# EAGLE design micromouse (EAGLE 9.6.2)
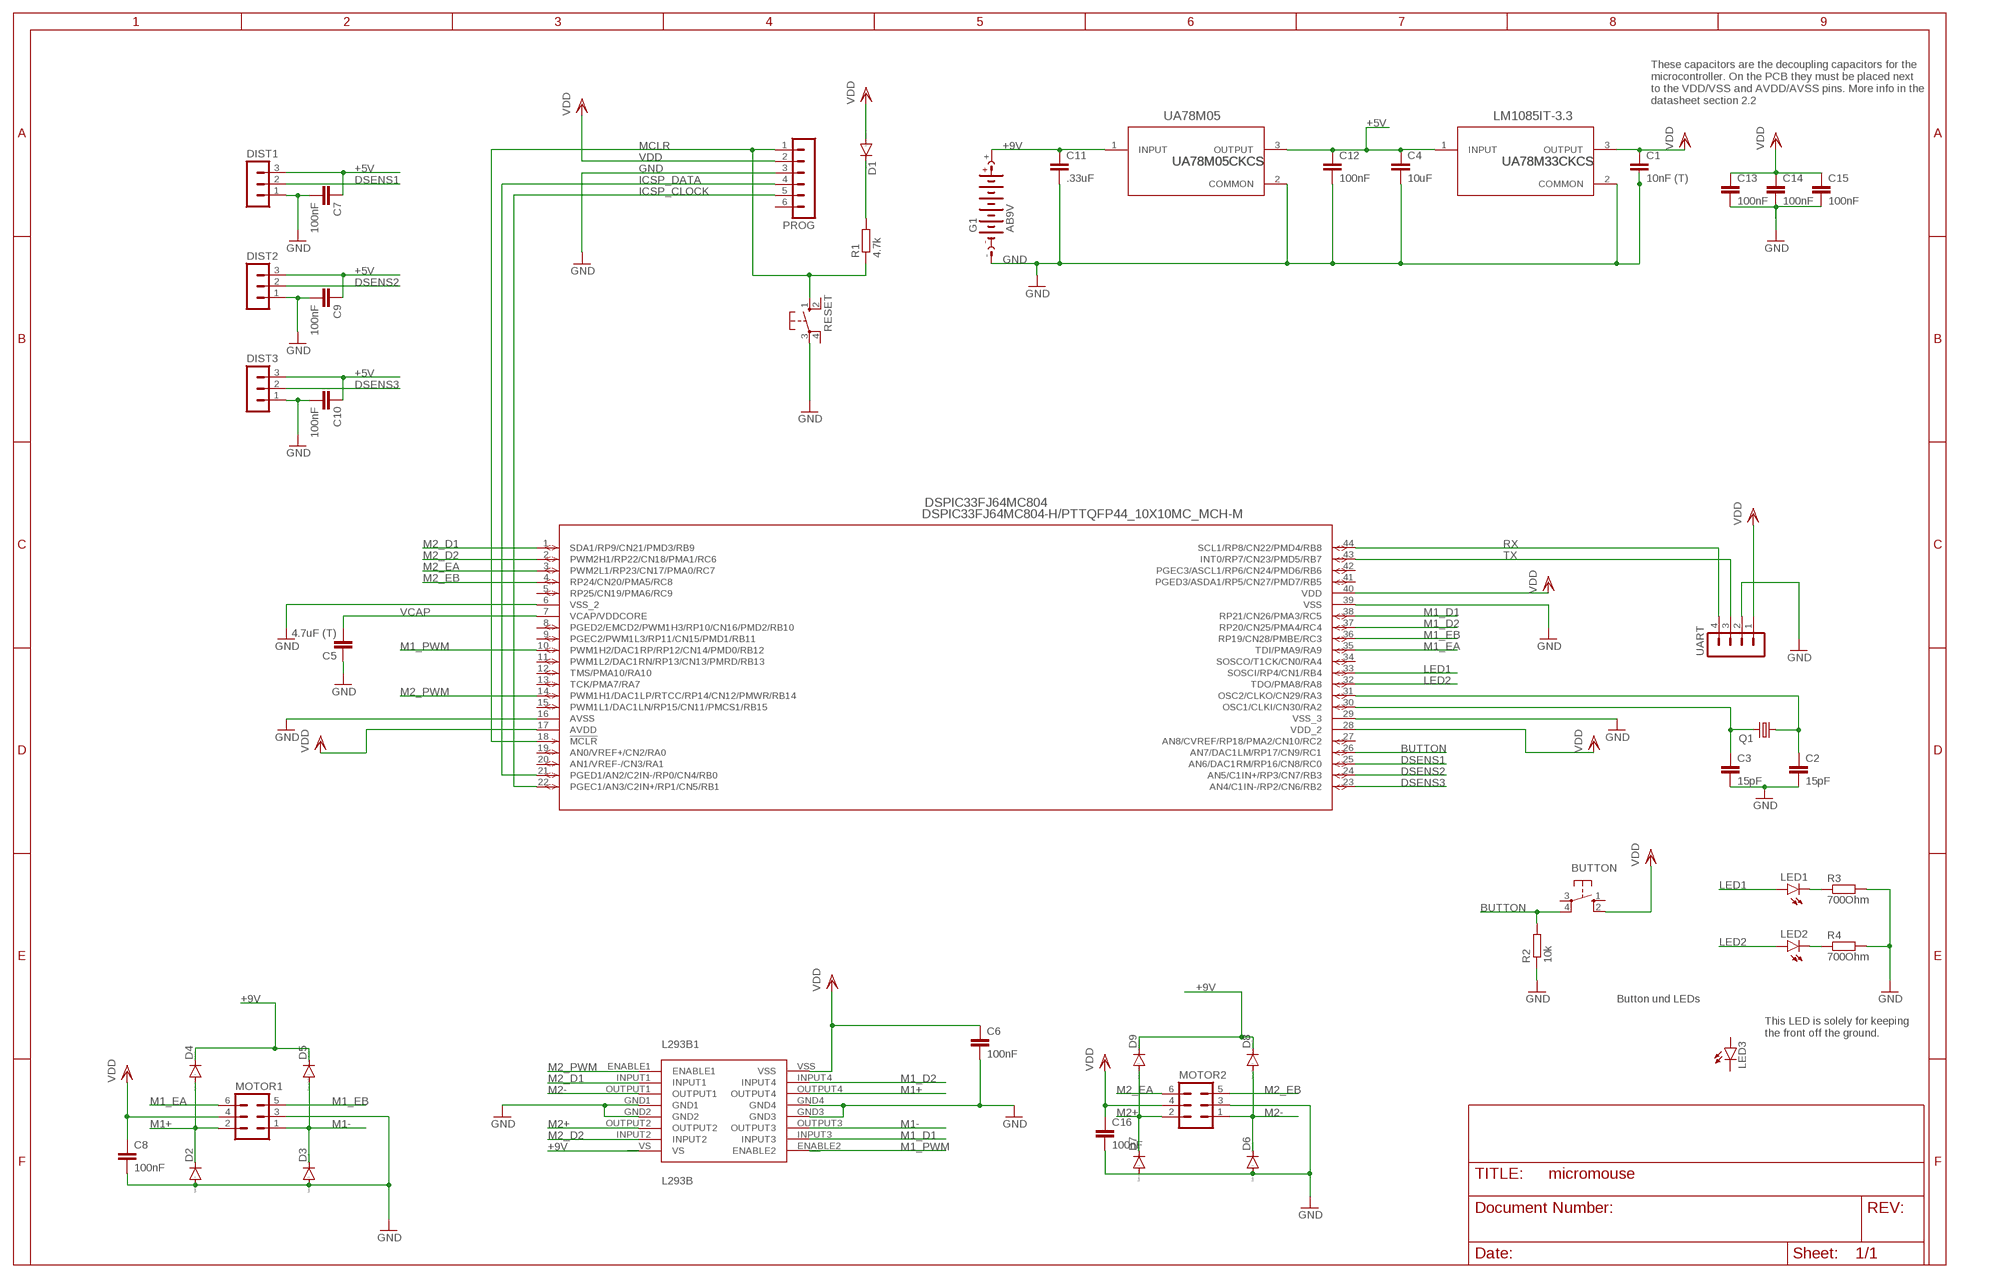
[diagram p0: schematic, sheet 1]

## Parts
BUTTON  10-XX  [B3F-10XX]
C1  10nF (T)  C-EUC0805  [C0805]
C2  15pF  C-EUC0805  [C0805]
C3  15pF  C-EUC0805  [C0805]
C4  10uF  C-EUC0805  [C0805]
C5  4.7uF (T)  C-EUC0805  [C0805]
C6  100nF  C-EUC0805  [C0805]
C7  100nF  C-EUC0805  [C0805]
C8  100nF  C-EUC0805  [C0805]
C9  100nF  C-EUC0805  [C0805]
C10  100nF  C-EUC0805  [C0805]
C11  .33uF  C-EUC0805  [C0805]
C12  100nF  C-EUC0805  [C0805]
C13  100nF  C-EUC0805  [C0805]
C14  100nF  C-EUC0805  [C0805]
C15  100nF  C-EUC0805  [C0805]
C16  100nF  C-EUC0805  [C0805]
D1  DIODE-SOD123  [SOD123]
D2  DIODE-SOD123  [SOD123]
D3  DIODE-SOD123  [SOD123]
D4  DIODE-SOD123  [SOD123]
D5  DIODE-SOD123  [SOD123]
D6  DIODE-SOD123  [SOD123]
D7  DIODE-SOD123  [SOD123]
D8  DIODE-SOD123  [SOD123]
D9  DIODE-SOD123  [SOD123]
DIST1  MA03-1  [MA03-1]
DIST2  MA03-1  [MA03-1]
DIST3  MA03-1  [MA03-1]
DSPIC33FJ64MC804  DSPIC33FJ64MC804-H/PTTQFP44_10X10MC_MCH-M  [TQFP44_10X10MC_MCH-M]
G1  AB9V  [AB9V]
L293B1  L293B  [L293P-DIP16]
LED1  LEDCHIP-LED0805  [CHIP-LED0805]
LED2  LEDCHIP-LED0805  [CHIP-LED0805]
LED3  LED5MM  [LED5MM]
LM1085IT-3.3  UA78M33CKCS  [KCS0003B]
MOTOR1  MA03-2  [MA03-2]
MOTOR2  MA03-2  [MA03-2]
PROG  MA06-1  [MA06-1]
Q1  CRYSTALHC49S  [HC49/S]
R1  4.7k  R-EU_R0805  [R0805]
R2  10k  R-EU_R0805  [R0805]
R3  700Ohm  R-EU_R0805  [R0805]
R4  700Ohm  R-EU_R0805  [R0805]
RESET  10-XX  [B3F-10XX]
UA78M05  UA78M05CKCS  [KCS0003B]
UART  MA04-1  [MA04-1]

## Nets
+5V: C4.1 C7.1 C9.1 C10.1 C12.1 DIST1.3 DIST2.3 DIST3.3 LM1085IT-3.3.1(INPUT) UA78M05.3(OUTPUT)
+9V: C11.1 D4.C D5.C D8.C D9.C G1.+ L293B1.VS UA78M05.1(INPUT)
BUTTON: BUTTON.4(P1) DSPIC33FJ64MC804.26(AN7/DAC1LM/RP17/CN9/RC1) R2.2
DSENS1: DIST1.2 DSPIC33FJ64MC804.25(AN6/DAC1RM/RP16/CN8/RC0)
DSENS2: DIST2.2 DSPIC33FJ64MC804.24(AN5/C1IN+/RP3/CN7/RB3)
DSENS3: DIST3.2 DSPIC33FJ64MC804.23(AN4/C1IN-/RP2/CN6/RB2)
GND: C1.2 C2.2 C3.2 C4.2 C5.1 C6.2 C7.2 C8.2 C9.2 C10.2 C11.2 C12.2 C13.2 C14.2 C15.2 C16.2 D2.A D3.A D6.A D7.A DIST1.1 DIST2.1 DIST3.1 DSPIC33FJ64MC804.6(VSS_2) DSPIC33FJ64MC804.16(AVSS) DSPIC33FJ64MC804.29(VSS_3) DSPIC33FJ64MC804.39(VSS) G1.- L293B1.GND1 L293B1.GND2 L293B1.GND3 L293B1.GND4 LM1085IT-3.3.2(COMMON) MOTOR1.3 MOTOR2.3 PROG.3 R2.1 R3.2 R4.2 RESET.3(P) UA78M05.2(COMMON) UART.2
ICSP_CLOCK: DSPIC33FJ64MC804.22(PGEC1/AN3/C2IN+/RP1/CN5/RB1) PROG.5
ICSP_DATA: DSPIC33FJ64MC804.21(PGED1/AN2/C2IN-/RP0/CN4/RB0) PROG.4
LED1: DSPIC33FJ64MC804.33(SOSCI/RP4/CN1/RB4) LED1.A
LED2: DSPIC33FJ64MC804.32(TDO/PMA8/RA8) LED2.A
M1+: D2.C D4.A L293B1.OUTPUT4 MOTOR1.2
M1-: D3.C D5.A L293B1.OUTPUT3 MOTOR1.1
M1_D1: DSPIC33FJ64MC804.38(RP21/CN26/PMA3/RC5) L293B1.INPUT3
M1_D2: DSPIC33FJ64MC804.37(RP20/CN25/PMA4/RC4) L293B1.INPUT4
M1_EA: DSPIC33FJ64MC804.35(TDI/PMA9/RA9) MOTOR1.6
M1_EB: DSPIC33FJ64MC804.36(RP19/CN28/PMBE/RC3) MOTOR1.5
M1_PWM: DSPIC33FJ64MC804.10(PWM1H2/DAC1RP/RP12/CN14/PMD0/RB12) L293B1.ENABLE2
M2+: D7.C D9.A L293B1.OUTPUT2 MOTOR2.2
M2-: D6.C D8.A L293B1.OUTPUT1 MOTOR2.1
M2_D1: DSPIC33FJ64MC804.1(SDA1/RP9/CN21/PMD3/RB9) L293B1.INPUT1
M2_D2: DSPIC33FJ64MC804.2(PWM2H1/RP22/CN18/PMA1/RC6) L293B1.INPUT2
M2_EA: DSPIC33FJ64MC804.3(PWM2L1/RP23/CN17/PMA0/RC7) MOTOR2.6
M2_EB: DSPIC33FJ64MC804.4(RP24/CN20/PMA5/RC8) MOTOR2.5
M2_PWM: DSPIC33FJ64MC804.14(PWM1H1/DAC1LP/RTCC/RP14/CN12/PMWR/RB14) L293B1.ENABLE1
MCLR: DSPIC33FJ64MC804.18(!MCLR) PROG.1 R1.1 RESET.1(S)
N$4: C3.1 DSPIC33FJ64MC804.30(OSC1/CLKI/CN30/RA2) Q1.2
N$5: C2.1 DSPIC33FJ64MC804.31(OSC2/CLKO/CN29/RA3) Q1.1
N$10: D1.C R1.2
N$12: LED1.C R3.1
N$13: LED2.C R4.1
RX: DSPIC33FJ64MC804.44(SCL1/RP8/CN22/PMD4/RB8) UART.4
TX: DSPIC33FJ64MC804.43(INT0/RP7/CN23/PMD5/RB7) UART.3
VCAP: C5.2 DSPIC33FJ64MC804.7(VCAP/VDDCORE)
VDD: BUTTON.2(S1) C1.1 C6.1 C8.1 C13.1 C14.1 C15.1 C16.1 D1.A DSPIC33FJ64MC804.17(AVDD) DSPIC33FJ64MC804.28(VDD_2) DSPIC33FJ64MC804.40(VDD) L293B1.VSS LM1085IT-3.3.3(OUTPUT) MOTOR1.4 MOTOR2.4 PROG.2 UART.1
Unconnected: BUTTON.1(S) BUTTON.3(P) DSPIC33FJ64MC804.5(RP25/CN19/PMA6/RC9) DSPIC33FJ64MC804.8(PGED2/EMCD2/PWM1H3/RP10/CN16/PMD2/RB10) DSPIC33FJ64MC804.9(PGEC2/PWM1L3/RP11/CN15/PMD1/RB11) DSPIC33FJ64MC804.11(PWM1L2/DAC1RN/RP13/CN13/PMRD/RB13) DSPIC33FJ64MC804.12(TMS/PMA10/RA10) DSPIC33FJ64MC804.13(TCK/PMA7/RA7) DSPIC33FJ64MC804.15(PWM1L1/DAC1LN/RP15/CN11/PMCS1/RB15) DSPIC33FJ64MC804.19(AN0/VREF+/CN2/RA0) DSPIC33FJ64MC804.20(AN1/VREF-/CN3/RA1) DSPIC33FJ64MC804.27(AN8/CVREF/RP18/PMA2/CN10/RC2) DSPIC33FJ64MC804.34(SOSCO/T1CK/CN0/RA4) DSPIC33FJ64MC804.41(PGED3/ASDA1/RP5/CN27/PMD7/RB5) DSPIC33FJ64MC804.42(PGEC3/ASCL1/RP6/CN24/PMD6/RB6) LED3.A LED3.K(C) PROG.6 RESET.2(S1) RESET.4(P1)

## Notes on the sheet
- Power Supply
- These capacitors are the decoupling capacitors for the
  microcontroller. On the PCB they must be placed next
  to the VDD/VSS and AVDD/AVSS pins. More info in the
  datasheet section 2.2
- Distance Sensors | Programmer
- Reset Button
- UART Connector
  (Bluethooth / USB)
- Oscillator
- Motor 2
- Motor 1
- Motor Control | Button und LEDs
- This LED is solely for keeping
  the front off the ground.

## Library data of the parts
BUTTON RESET = switch-omron:10-XX: OMRON SWITCH; MPN: B3F-1000; OC_FARNELL: 176432; OC_NEWARK: 36M3542
C1-C16 = rcl:C-EU: CAPACITOR, European symbol; SPICEPREFIX: C
D1-D9 = diode:DIODE-: DIODE
DIST1-DIST3 = con-lstb:MA03-1: PIN HEADER; OC_FARNELL: unknown; OC_NEWARK: unknown
DSPIC33FJ64MC804 = micromouse:DSPIC33FJ64MC804-H/PT; COPYRIGHT: Copyright (C) 2022 Ultra Librarian. All rights reserved.; MANUFACTURER_PART_NUMBER: DSPIC33FJ64MC804-H/PT; MFR_NAME: Microchip
G1 = battery:AB9V: 9-V BATTERY CLIP
L293B1 = micromouse:L293B
LED1-LED3 = led:LED: LED OSRAM: - CHIPLED LG R971, LG N971, LY N971, LG Q971, LY Q971, LO R971, LY R971 LH N974, LH R974 LS Q976, LO Q976, LY Q976 LO Q996 - Hyper CHIPLED LW Q18S LB Q993, LB Q99A, LB R99A - SideLED LS A670, LO A670, LY A670, LG A670, LP A670 LB A673, LV A673, LT A673, LW A673 LH A674 LY A675 LS A676, LA A676, LO A676, LY A676, LW A676 LS A679, LY A679, LG A679 - Hyper Micro SIDELED® LS Y876, LA Y876, LO Y876, LY Y876 LT Y87S - SmartLED LW L88C, LW L88S LB L89C, LB L89S, LG L890 LS L89K, LO L89K, LY L89K LS L896, LA L896, LO L896, LY L896 - TOPLED LS T670, LO T670, LY T670, LG T670, LP T670 LSG T670, LSP T670, LSY T670, LOP T670, LYG T670 LG T671, LOG T671, LSG T671 LB T673, LV T673, LT T673, LW T673 LH T674 LS T676, LA T676, LO T676, LY T676, LB T676, LH T676, LSB T676, LW T676 LB T67C, LV T67C, LT T67C, LS T67K, LO T67K, LY T67K, LW E67C LS E67B, LA E67B, LO E67B, LY E67B, LB E67C, LV E67C, LT E67C LW T67C LS T679, LY T679, LG T679 LS T770, LO T770, LY T770, LG T770, LP T770 LB T773, LV T773, LT T773, LW T773 LH T774 LS E675, LA E675, LY E675, LS T675 LS T776, LA T776, LO T776, LY T776, LB T776 LHGB T686 LT T68C, LB T68C - Hyper Mini TOPLED® LB M676 - Mini TOPLED Santana® LG M470 LS M47K, LO M47K, LY M47K Source: http://www.osram.convergy.de LUXEON: - LUMILED® LXK2-PW12-R00, LXK2-PW12-S00, LXK2-PW14-U00, LXK2-PW14-V00 LXK2-PM12-R00, LXK2-PM12-S00, LXK2-PM14-U00 LXK2-PE12-Q00, LXK2-PE12-R00, LXK2-PE12-S00, LXK2-PE14-T00, LXK2-PE14-U00 LXK2-PB12-K00, LXK2-PB12-L00, LXK2-PB12-M00, LXK2-PB14-N00, LXK2-PB14-P00, LXK2-PB14-Q00 LXK2-PR12-L00, LXK2-PR12-M00, LXK2-PR14-Q00, LXK2-PR14-R00 LXK2-PD12-Q00, LXK2-PD12-R00, LXK2-PD12-S00 LXK2-PH12-R00, LXK2-PH12-S00 LXK2-PL12-P00, LXK2-PL12-Q00, LXK2-PL12-R00 Source: www.luxeon.com KINGBRIGHT: KA-3528ASYC Source: www.kingbright.com
LM1085IT-3.3 = micromouse:UA78M33CKCS; COPYRIGHT: Copyright (C) 2022 Ultra Librarian. All rights reserved.; MANUFACTURER_PART_NUMBER: UA78M05CKCS; MFR_NAME: Texas Instruments; REFDES: RefDes; TYPE: TYPE
MOTOR1 MOTOR2 = con-lstb:MA03-2: PIN HEADER; OC_FARNELL: unknown; OC_NEWARK: unknown
PROG = con-lstb:MA06-1: PIN HEADER; OC_FARNELL: unknown; OC_NEWARK: unknown
Q1 = crystal:CRYSTAL: CRYSTAL; OC_FARNELL: 1667008; OC_NEWARK: unknown
R1-R4 = rcl:R-EU_: RESISTOR, European symbol; SPICEPREFIX: R
UA78M05 = micromouse:UA78M05CKCS; COPYRIGHT: Copyright (C) 2022 Ultra Librarian. All rights reserved.; MANUFACTURER_PART_NUMBER: UA78M05CKCS; MFR_NAME: Texas Instruments; REFDES: RefDes; TYPE: TYPE
UART = con-lstb:MA04-1: PIN HEADER; OC_FARNELL: unknown; OC_NEWARK: unknown

## Board
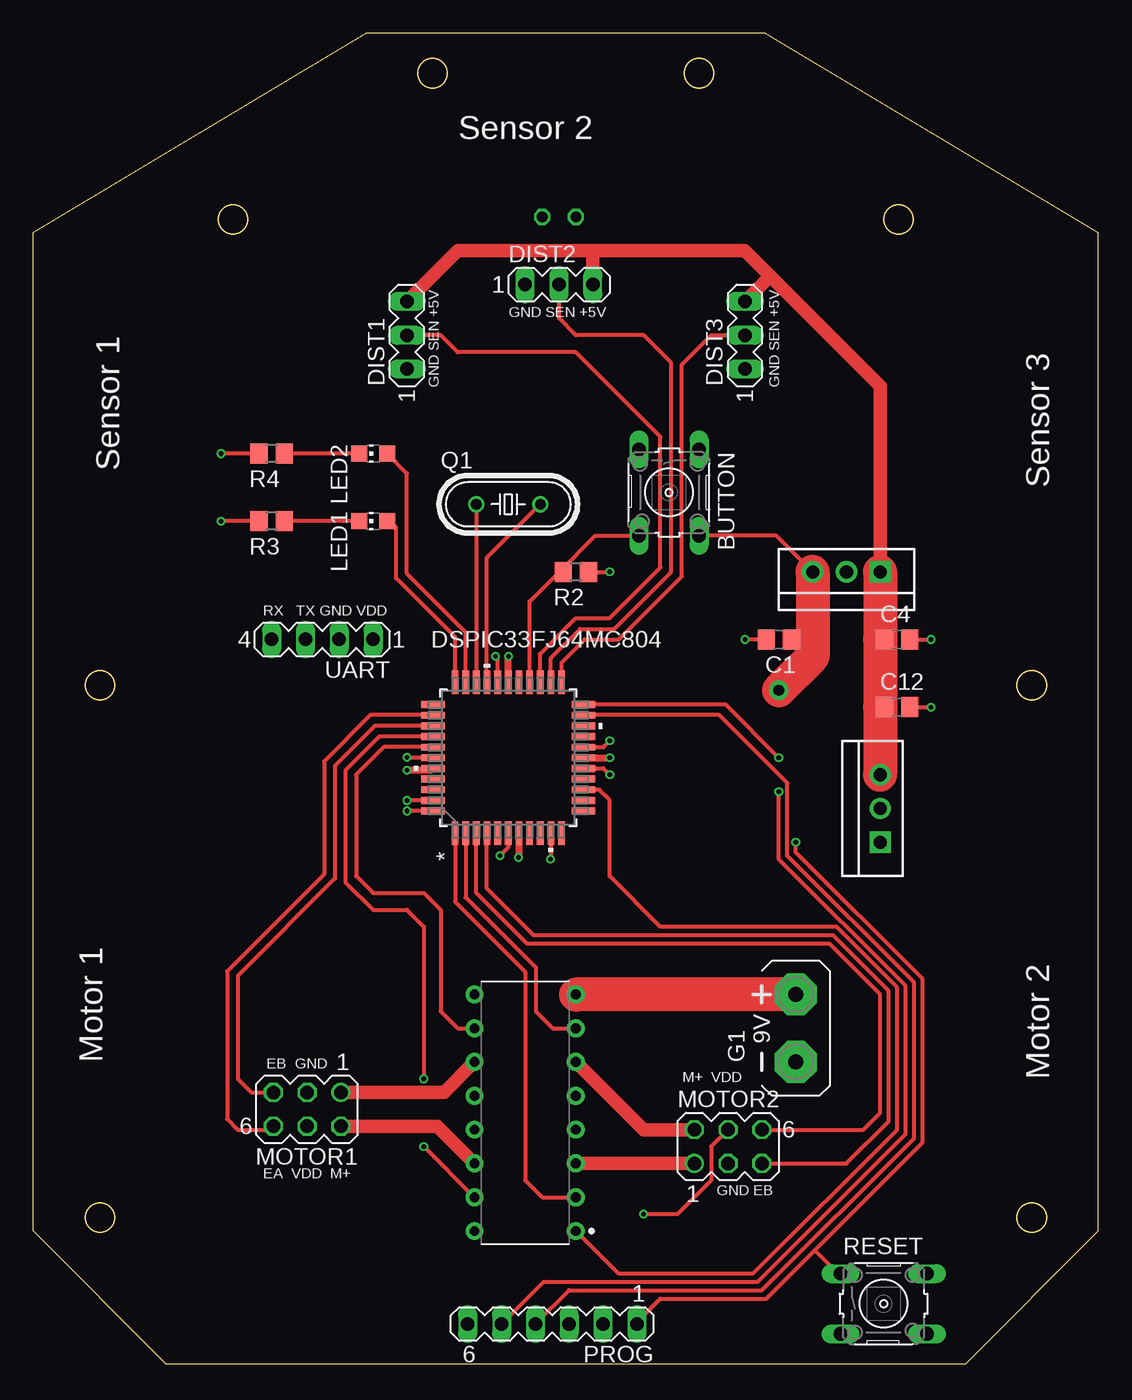
[diagram p1: board, top side]
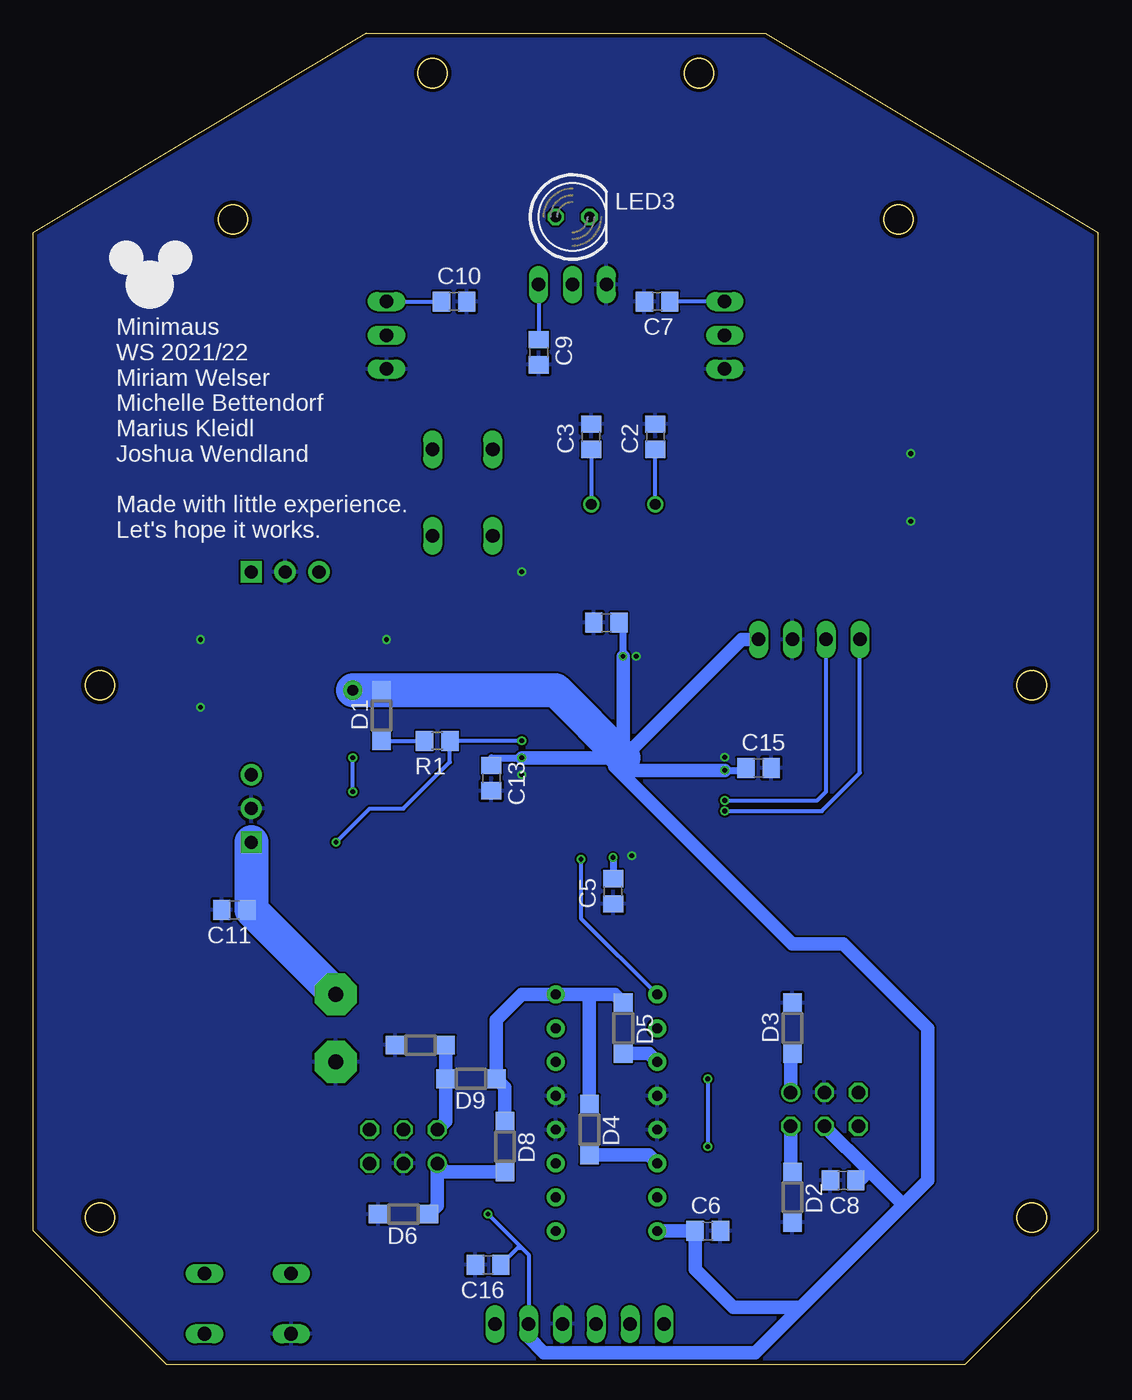
[diagram p2: board, bottom side, seen from below]

Size 80 x 100 mm. Coordinates in mm from the lower left corner, seen from the top.
Outline: 70,0 80,10 80,85 55,100 25,100 0,85 0,10 10,0 70,0
Outline: circle at 75,11 radius 1.1
Outline: circle at 5,51 radius 1.1
Outline: circle at 30,97 radius 1.1
Outline: circle at 15,86.01 radius 1.1
Outline: circle at 5,11 radius 1.1
Outline: circle at 75,51 radius 1.1
Outline: circle at 50,97 radius 1.1
Outline: circle at 65,86.01 radius 1.1
Copper layers (1*16): Top 0.035mm / dielectric 1.5mm / Bottom 0.035mm
Design rules "PCB-POOL Standard": minimum track width 0.15mm, minimum drill 0.3mm, track to track 0.15mm, track to pad 0.15mm, pad to pad 0.15mm, via to via 0.15mm, smd to smd 0.15mm, copper to edge 0.3mm, drill to drill 0.2mm, minimum pad ring 0.2mm, minimum via ring 0.15mm, stop-mask expansion 0.03mm, vias tented up to drill 0mil, thermal gap 0.2mm

### Footprints (pad centres in the part's own frame; a part is rotated, then mirrored left to right if it is on the bottom)
B3F-10XX = drill 1.016 long: 1 -3.251,2.261; 2 3.251,2.261; 3 -3.251,-2.261; 4 3.251,-2.261
C0805 = smd 1.3 x 1.5: 1 -0.95,0; 2 0.95,0
SOD123 = smd 1.4 x 1.4: A 1.9,0; C -1.9,0
MA03-1 = drill 1.016 long: 1 -2.54,0; 2 0,0; 3 2.54,0
TQFP44_10X10MC_MCH-M = smd 1.762 x 0.507: 1 -5.663,4; 2 -5.663,3.2; 3 -5.663,2.4; 4 -5.663,1.6; 5 -5.663,0.8; 6 -5.663,0; 7 -5.663,-0.8; 8 -5.663,-1.6; 9 -5.663,-2.4; 10 -5.663,-3.2; 11 -5.663,-4; 23 5.663,-4; 24 5.663,-3.2; 25 5.663,-2.4; 26 5.663,-1.6; 27 5.663,-0.8; 28 5.663,0; 29 5.663,0.8; 30 5.663,1.6; 31 5.663,2.4; 32 5.663,3.2; 33 5.663,4 | smd 0.507 x 1.762: 12 -4,-5.663; 13 -3.2,-5.663; 14 -2.4,-5.663; 15 -1.6,-5.663; 16 -0.8,-5.663; 17 0,-5.663; 18 0.8,-5.663; 19 1.6,-5.663; 20 2.4,-5.663; 21 3.2,-5.663; 22 4,-5.663; 34 4,5.663; 35 3.2,5.663; 36 2.4,5.663; 37 1.6,5.663; 38 0.8,5.663; 39 0,5.663; 40 -0.8,5.663; 41 -1.6,5.663; 42 -2.4,5.663; 43 -3.2,5.663; 44 -4,5.663
AB9V = drill 1.118 pad 3.15 octagon: + 0,2.54; - 0,-2.54
L293P-DIP16 = drill 0.743 pad 1.343: ENABLE1 -3.81,8.89; ENABLE2 3.81,-8.89; GND1 -3.81,1.27; GND2 -3.81,-1.27; GND3 3.81,-1.27; GND4 3.81,1.27; INPUT1 -3.81,6.35; INPUT2 -3.81,-6.35; INPUT3 3.81,-6.35; INPUT4 3.81,6.35; OUTPUT1 -3.81,3.81; OUTPUT2 -3.81,-3.81; OUTPUT3 3.81,-3.81; OUTPUT4 3.81,3.81; VS -3.81,-8.89; VSS 3.81,8.89
CHIP-LED0805 = smd 1.2 x 1.2: A 0,-1.05; C 0,1.05
LED5MM = drill 0.813 octagon: A -1.27,0; K 1.27,0
KCS0003B = drill 0.991 pad 1.6 square: 1 0,2.54 | drill 0.991 pad 1.6: 2 0,0; 3 0,-2.54
MA03-2 = drill 1.016: 1 -2.54,-1.27 | drill 1.016 octagon: 2 -2.54,1.27; 3 0,-1.27; 4 0,1.27; 5 2.54,-1.27; 6 2.54,1.27
MA06-1 = drill 1.016 long: 1 -6.35,0; 2 -3.81,0; 3 -1.27,0; 4 1.27,0; 5 3.81,0; 6 6.35,0
HC49/S = drill 0.813: 1 -2.413,0; 2 2.413,0
R0805 = smd 1.3 x 1.5: 1 -0.95,0; 2 0.95,0
MA04-1 = drill 1.016 long: 1 -3.81,0; 2 -1.27,0; 3 1.27,0; 4 3.81,0

### Placement (x,y rotation side)
BUTTON  47.75,65.49 270 top
C1  56,54.45 180 top
C2  33.27,69.68 90 bottom
C3  38.09,69.68 90 bottom
C4  64.89,54.45 0 top
C5  36.44,35.52 90 bottom
C6  29.33,10 0 bottom
C7  33.14,79.84 180 bottom
C8  19.17,13.81 180 bottom
C9  42.03,76.03 270 bottom
C10  48.38,79.84 0 bottom
C11  64.89,34.12 180 bottom
C12  64.89,49.37 0 top
C13  45.59,44.03 270 bottom
C14  36.95,55.72 180 bottom
C15  25.52,44.79 0 bottom
C16  45.84,7.46 180 bottom
D1  53.84,48.73 90 bottom
D2  22.98,12.54 270 bottom
D3  22.98,25.23 90 bottom
D4  38.22,17.62 270 bottom
D5  35.68,25.23 270 bottom
D6  52.19,11.27 180 bottom
D7  50.92,23.96 180 bottom
D8  44.57,16.35 270 bottom
D9  47.11,21.43 180 bottom
DIST1  28.06,77.3 90 top
DIST2  39.49,81.11 0 top
DIST3  53.46,77.3 90 top
DSPIC33FJ64MC804  35.68,45.55 90 top
G1  57.27,25.23 0 top
L293B1  36.95,18.89 180 top
LED1  25.52,63.34 90 top
LED2  25.52,68.41 90 top
LED3  39.49,86.19 0 bottom
LM1085IT-3.3  61.08,59.52 270 top
MOTOR1  20.57,19.14 180 top
MOTOR2  52.19,16.35 0 top
PROG  38.98,3.01 180 top
Q1  35.68,64.6 0 top
R1  49.65,46.83 180 bottom
R2  40.76,59.52 180 top
R3  17.9,63.34 180 top
R4  17.9,68.41 180 top
RESET  63.88,4.53 0 top
UA78M05  63.62,41.74 180 top
UART  21.71,54.45 180 top

### Tracks (layer width: path | path; a pad name or v marks a point on that pad's centre or on a via)
+5V
  Top 1.016: LM1085IT-3.3.1 63.62,73.49 55.37,81.75 | 55.37,81.75 53.46,83.65 42.03,83.65 | 42.03,83.65 31.87,83.65 DIST1.3 | 42.03,83.65 DIST2.3 | DIST3.3 55.37,81.75 | C4.1 63.62,54.45 | C12.1 63.62,49.37
  Top 2.54: LM1085IT-3.3.1 63.62,54.45 63.62,49.37 UA78M05.3
  Bottom 0.305: DIST1.3 C7.1 | DIST2.3 C9.1 | DIST3.3 C10.1
+9V
  Top 2.54: G1.+ L293B1.VS
  Bottom 1.016: C11.1 63.62,34.12 | D4.C 38.22,27.78 | 38.22,27.78 L293B1.VS 43.3,27.78 45.21,25.87 D9.C 44.57,20.79 D8.C | 38.22,27.78 36.32,27.78 D5.C
  Bottom 2.54: UA78M05.1 63.62,34.12 G1.+
BUTTON
  Top 0.305: DSPIC33FJ64MC804.26 37.28,57.31 39.49,59.52 | BUTTON.4 42.21,62.24 39.49,59.52 | R2.2 39.49,59.52
DSENS1
  Top 0.305: DIST1.2 30.6,77.3 31.87,76.03 40.76,76.03 47.11,69.68 47.11,59.86 43.3,56.05 40.76,56.05 38.08,53.37 DSPIC33FJ64MC804.25
DSENS2
  Top 0.305: DIST2.2 39.49,78.57 40.76,77.3 45.84,77.3 47.91,75.23 47.91,59.52 43.63,55.24 41.09,55.24 38.88,53.04 DSPIC33FJ64MC804.24
DSENS3
  Top 0.305: DSPIC33FJ64MC804.23 39.68,52.71 41.42,54.45 43.97,54.45 48.71,59.19 48.71,75.09 50.92,77.3 DIST3.2
GND  (via drill 0.35)
  Top 0.305: R4.2 v14.09,68.41 | R3.2 v14.09,63.34 | DSPIC33FJ64MC804.29 34.88,53 v34.71,53.18 | DSPIC33FJ64MC804.16 42.83,44.76 v43.3,44.29 | DSPIC33FJ64MC804.6 35.68,38.82 v35.05,38.19 | C4.2 v67.43,54.45 | DSPIC33FJ64MC804.39 28.1,45.55 v28.06,45.59 | R2.1 v43.3,59.52 | C12.2 v67.43,49.37 | C1.2 v53.46,54.45
  pour Bottom: 10.28,-0.17 0.12,10 0.12,84.92 15.36,100.16 64.89,100.16 80.13,84.92 80.13,10 69.97,-0.17
ICSP_CLOCK  (via drill 0.35)
  Top 0.305: PROG.5 38.35,6.18 54.42,6.18 65.53,17.3 65.53,28.41 56,37.94 v56,43.02 | v56,45.55 52,49.55 DSPIC33FJ64MC804.22
  Bottom 0.305: v56,43.02 v56,45.55
ICSP_DATA
  Top 0.305: DSPIC33FJ64MC804.21 51.53,48.76 56.64,43.65 56.64,38.2 66.16,28.67 66.16,16.98 54.73,5.55 40.25,5.55 PROG.4
LED1
  Top 0.305: LED1.A 26.79,63.34 27.26,62.87 27.26,59.05 31.68,54.63 DSPIC33FJ64MC804.33
LED2
  Top 0.305: DSPIC33FJ64MC804.32 32.48,54.97 28.06,59.39 28.06,66.92 LED2.A
M1+
  Top 1.016: MOTOR1.2 30.35,17.87 L293B1.OUTPUT4
  Bottom 1.016: MOTOR1.2 23.11,14.56 D2.C | L293B1.OUTPUT4 33.78,15.72 D4.A
M1-
  Top 1.016: L293B1.OUTPUT3 30.86,20.41 MOTOR1.1
  Bottom 1.016: D3.C 23.11,23.21 MOTOR1.1 | L293B1.OUTPUT3 33.78,23.34 D5.A
M1_D1
  Top 0.305: DSPIC33FJ64MC804.38 26.32,46.36 24.25,44.29 24.25,36.66 25.52,35.4 29.33,35.4 30.6,34.12 30.6,26.51 31.87,25.23 L293B1.INPUT3
M1_D2  (via drill 0.35)
  Top 0.305: DSPIC33FJ64MC804.37 25.99,47.16 23.45,44.62 23.45,36.2 25.52,34.12 28.06,34.12 29.33,32.86 v29.33,21.43 | v29.33,16.35 L293B1.INPUT4
  Bottom 0.305: v29.33,21.43 v29.33,16.35
M1_EA
  Top 0.305: DSPIC33FJ64MC804.35 25.33,48.76 21.85,45.28 21.85,36.8 14.56,29.52 14.56,18.41 15.36,17.62 17.77,17.62 MOTOR1.6
M1_EB
  Top 0.305: DSPIC33FJ64MC804.36 25.66,47.95 22.65,44.95 22.65,36.47 15.36,29.18 15.36,21.43 16.38,20.41 MOTOR1.5
M1_PWM  (via drill 0.35)
  Top 0.305: DSPIC33FJ64MC804.10 38.88,37.96 v38.86,37.94
  Bottom 0.305: v38.86,37.94 38.86,33.49 L293B1.ENABLE2
M2+
  Top 1.016: MOTOR2.2 45.84,17.62 L293B1.OUTPUT2
  Bottom 1.016: MOTOR2.2 49.01,18.26 D9.A D7.C
M2-
  Top 1.016: MOTOR2.1 L293B1.OUTPUT1
  Bottom 1.016: D8.A 49.02,14.45 MOTOR2.1 49.65,11.91 D6.C
M2_D1
  Top 0.305: DSPIC33FJ64MC804.1 31.68,34.73 36.95,29.46 36.95,13.81 38.22,12.54 L293B1.INPUT1
M2_D2
  Top 0.305: DSPIC33FJ64MC804.2 32.48,35.06 37.75,29.79 37.75,26.51 39.02,25.23 L293B1.INPUT2
M2_EA
  Top 0.305: MOTOR2.6 62.35,17.62 63.62,18.89 63.62,27.78 59.81,31.59 37.09,31.59 33.28,35.39 DSPIC33FJ64MC804.3
M2_EB
  Top 0.305: MOTOR2.5 61.08,15.08 64.26,18.25 64.26,28.04 60.08,32.22 37.59,32.22 34.08,35.73 DSPIC33FJ64MC804.4
M2_PWM
  Top 0.305: L293B1.ENABLE1 43.94,6.82 54.1,6.82 64.89,17.62 64.89,28.3 60.34,32.86 47.11,32.86 43.3,36.66 43.3,42.38 42.53,43.16 DSPIC33FJ64MC804.14
MCLR  (via drill 0.35)
  Top 0.305: PROG.1 45.33,3.14 47.11,4.92 55.05,4.92 58.7,8.57 | DSPIC33FJ64MC804.18 42.83,46.36 v43.3,46.83 | 58.7,8.57 66.8,16.66 66.8,28.94 57.27,38.46 v57.27,39.2 | RESET.1 60.47,6.79 58.7,8.57
  Bottom 0.305: v43.3,46.83 R1.1 48.7,45.23 52.19,41.74 54.73,41.74 v57.27,39.2
N$4
  Top 0.305: DSPIC33FJ64MC804.30 34.08,60.59 Q1.2
  Bottom 0.305: C3.1 Q1.2
N$5
  Top 0.305: Q1.1 33.27,51.23 DSPIC33FJ64MC804.31
  Bottom 0.305: Q1.1 C2.1
N$10
  Bottom 0.305: D1.C R1.2
N$12
  Top 0.305: LED1.C R3.1
N$13
  Top 0.305: LED2.C R4.1
RX  (via drill 0.35)
  Top 0.305: DSPIC33FJ64MC804.44 v28.06,41.55
  Bottom 0.305: v28.06,41.55 20.77,41.55 17.9,44.42 UART.4
TX  (via drill 0.35)
  Top 0.305: DSPIC33FJ64MC804.43 v28.06,42.36
  Bottom 0.305: v28.06,42.36 21.1,42.36 20.44,43.02 UART.3
VCAP  (via drill 0.35)
  Top 0.305: 36.48,38.1 v36.44,38.06
  Top 0.508: DSPIC33FJ64MC804.7 36.48,38.1
  Bottom 0.508: v36.44,38.06 C5.2
VDD  (via drill 0.35, 0.8)
  Top 0.305: LM1085IT-3.3.3 55.82,62.24 BUTTON.2 | MOTOR2.4 50.92,16.35 50.92,13.81 48.38,11.27 v45.84,11.27
  Top 0.508: DSPIC33FJ64MC804.17 v43.3,45.55 | DSPIC33FJ64MC804.40 29.88,44.61 28.97,44.61 v28.06,44.61 | DSPIC33FJ64MC804.28 v35.68,53.16 v35.69,53.18
  Top 1.27: C1.1 58.54,54.45
  Top 2.54: LM1085IT-3.3.3 58.54,54.45 58.54,53.18 v56,50.63
  Bottom 0.305: C13.1 45.57,45.55 | v45.84,11.27 43.3,8.73 | 43.3,8.73 42.79,8.22 PROG.2 | D1.A 53.47,50.63 53.46,50.63 | C16.1 43.62,8.73 43.3,8.73
  Bottom 0.508: 45.57,45.55 v43.3,45.55 | v28.06,44.61 26.66,44.61 C15.1 | v35.69,53.18 35.69,55.41 C14.1
  Bottom 1.016: 35.68,45.55 36.32,44.92 22.98,31.59 19.17,31.59 12.82,25.23 12.82,13.81 14.73,11.9 | v43.3,45.55 35.68,45.55 | 35.68,45.55 34.74,44.61 v28.06,44.61 | UART.1 26.79,54.45 35.68,45.55 | PROG.2 42.79,1.99 41.65,0.85 25.78,0.85 22.35,4.28 | 14.73,11.9 22.35,4.28 | L293B1.VSS C6.1 30.28,7.13 27.43,4.28 22.35,4.28 | MOTOR1.4 17.2,14.5 | 17.2,14.5 14.73,12.03 14.73,11.9 | 35.68,45.55 35.68,52.76 35.69,52.77 v35.69,53.18 | C8.1 17.9,13.81 17.2,14.5
  Bottom 2.54: 35.68,45.55 40.76,50.63 53.46,50.63 v56,50.63

### Text on the board
tPlace: Sensor 2 | GND SEN +5V | GND SEN +5V | GND SEN +5V | Sensor 1 | Sensor 3 | RX TX GND VDD | Motor 1 | EB GND | Motor 2 | M+ VDD | EA VDD M+ | GND EB
bPlace: Minimaus / WS 2021/22 / Miriam Welser / Michelle Bettendorf / Marius Kleidl / Joshua Wendland / / Made with little experience. / Let's hope it works.
Document: Front | Dashed area should not be / used to place components / because parts will be mounted / there. | Back